# Altium schematic sheet 000-Cover.SchDoc: Cover
size A4; Author: XOT; Organization: Altium Limited; Address1: L3, 12a Rodborough Rd; Address2: Frenchs Forest; Address3: NSW; Address4: Australia 2086; DocumentNumber: 000; SheetNumber: 0; SheetTotal: 0
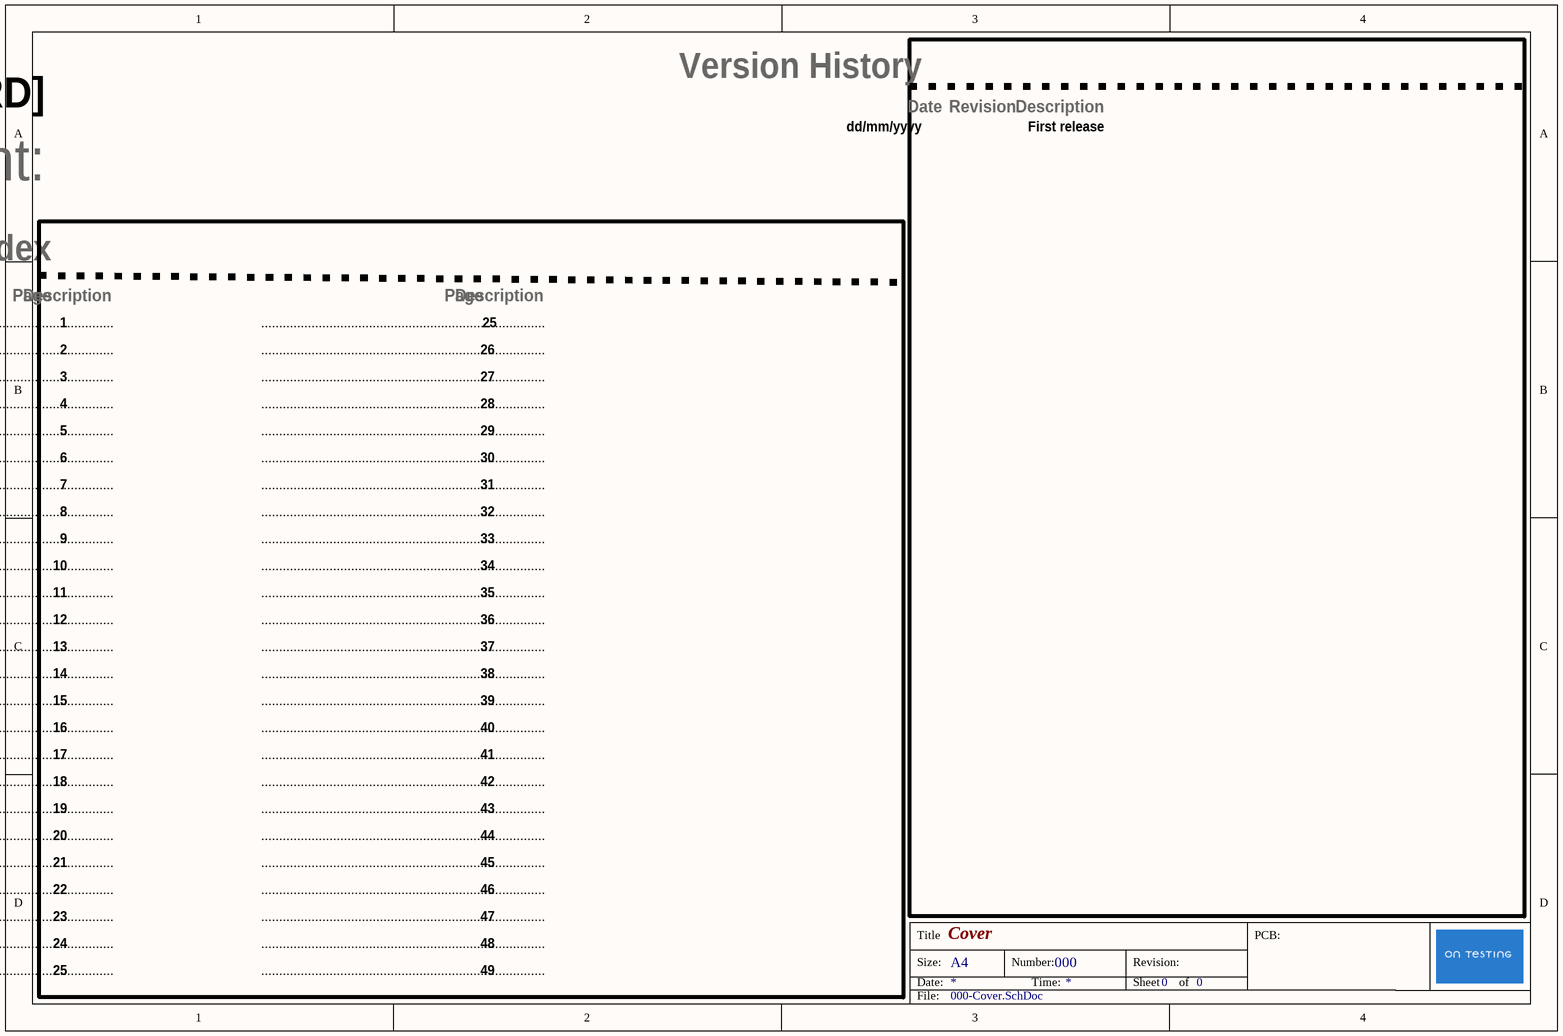
[diagram p0: 000-Cover.SchDoc]

## Notes on the sheet
- [COMPANY] - [PROJECT] - [BOARD]
- Version History
- Date
- Revision
- Description
- Variant:
- dd/mm/yyyy
- First release
- Index
- Page
- 1
- 2
- 3
- ...............................................................................
- 26
- 27
- 25
- 4
- 5
- 28
- 29
- 6
- 7
- 8
- 30
- 31
- 32
- 9
- 10
- 33
- 34
- 11
- 12
- 13
- 35
- 36
- 37
- 14
- 15
- 38
- 39
- 16
- 17
- 18
- 40
- 41
- 42
- 19
- 20
- 43
- 44
- 21
- 22
- 23
- 45
- 46
- 47
- 24
- 48
- 49
- PCB:
- Title
- Size:
- Date:
- A4
- Number:
- Time:
- Revision:
- Sheet
- of
- File: